# Altium schematic sheet LCDTFT_FPC40P_SPI.SchDoc
size A3; SheetNumber: 11; SheetTotal: 13
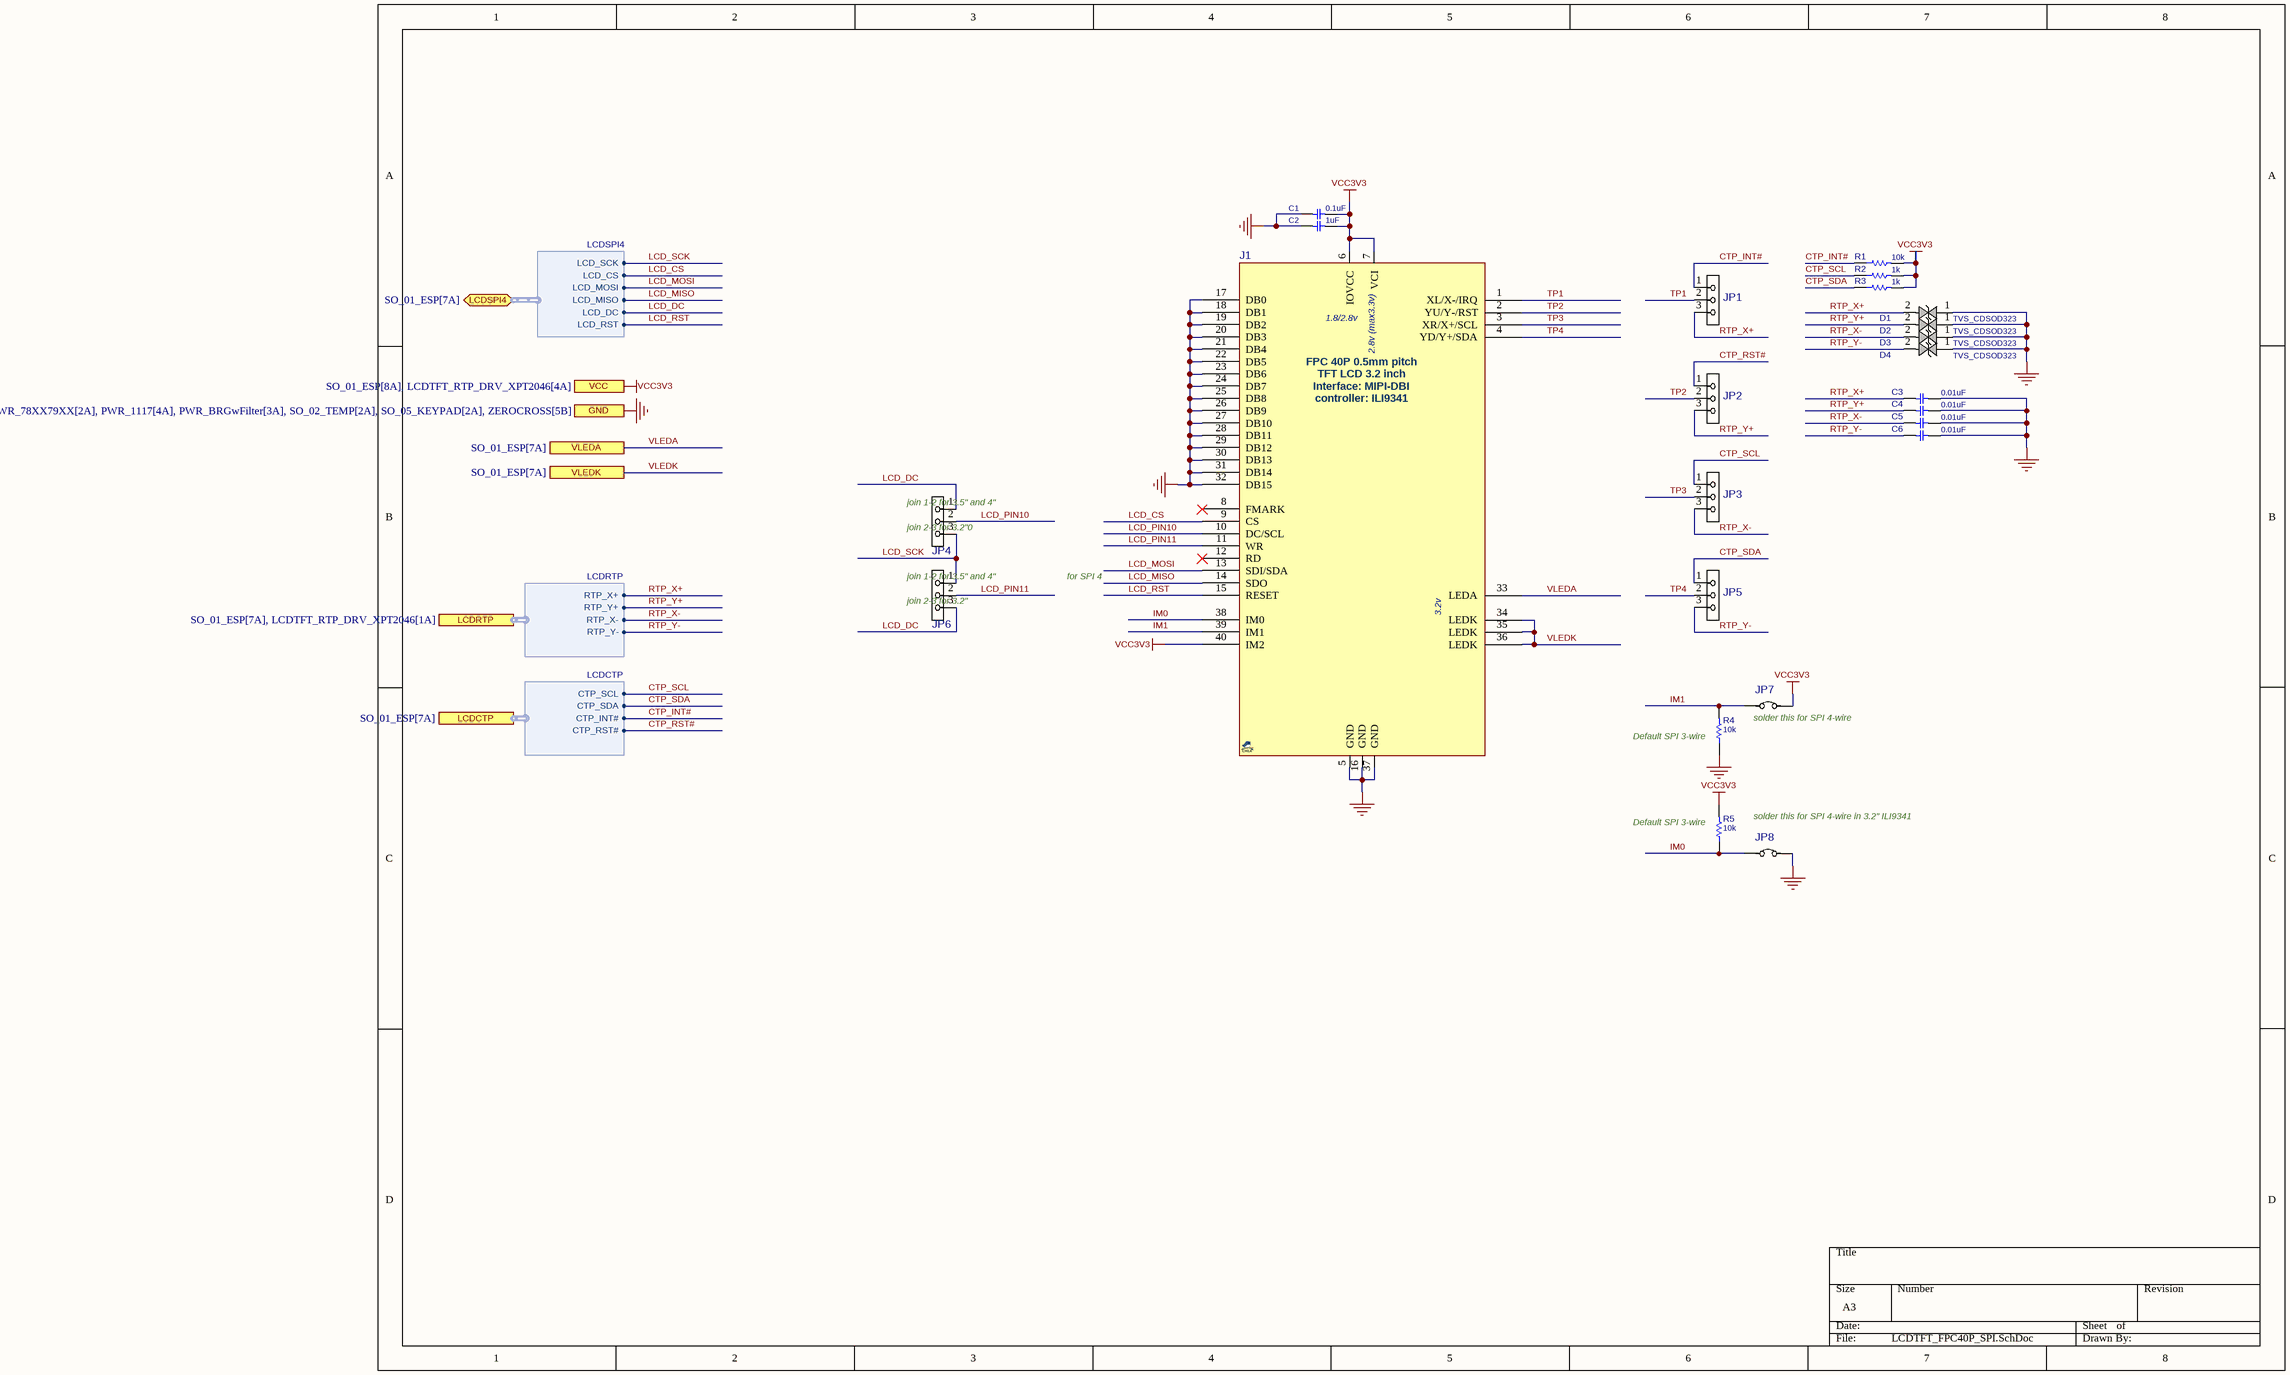
[diagram p0: LCDTFT_FPC40P_SPI.SchDoc]

## Parts
C1  0.1uF  [C0402]
C2  1uF  [C0402]
C3  0.01uF  [C0402]
C4  0.01uF  [C0402]
C5  0.01uF  [C0402]
C6  0.01uF  [C0402]
D1  TVS_CDSOD323  [D0805]
D2  TVS_CDSOD323  [D0805]
D3  TVS_CDSOD323  [D0805]
D4  TVS_CDSOD323  [D0805]
J1  FPC50_40  [FPC50_40T]  (value not drawn)
JP1  JMPHDR3PIN  [JP_3_60W]  (value not drawn)
JP2  JMPHDR3PIN  [JP_3_60W]  (value not drawn)
JP3  JMPHDR3PIN  [JP_3_60W]  (value not drawn)
JP4  JMPHDR3PIN  [JP_3_60W]  (value not drawn)
JP5  JMPHDR3PIN  [JP_3_60W]  (value not drawn)
JP6  JMPHDR3PIN  [JP_3_60W]  (value not drawn)
JP7  JMPSOLDER  [JP_60X100]  (value not drawn)
JP8  JMPSOLDER  [JP_60X100]  (value not drawn)
R1  10k  [R0402]
R2  1k  [R0402]
R3  1k  [R0402]
R4  10k  [R0402]
R5  10k  [R0402]

## Ports
GND (see SO_01_ESP[8A], ACCTRL_OPTOTRIAC[1A], DRV_BJT[1A], I2C_GPIOEXPANDER_PCF8574[1A], LCDTFT_RTP_DRV_XPT2046[4B], LEDBAKL_MP3202_AP3032[1B], PWR_78XX79XX[2A], PWR_1117[4A], PWR_BRGwFilter[3A], SO_02_TEMP[2A], SO_05_KEYPAD[2A], ZEROCROSS[5B]), LCDCTP (harness LCDCTP, see SO_01_ESP[7A]), LCDRTP (harness LCDRTP, see SO_01_ESP[7A], LCDTFT_RTP_DRV_XPT2046[1A]), LCDSPI4 (bidir, harness LCDSPI4, see SO_01_ESP[7A]), VCC (see SO_01_ESP[8A], LCDTFT_RTP_DRV_XPT2046[4A]), VLEDA (see SO_01_ESP[7A]), VLEDK (see SO_01_ESP[7A])

## Harnesses
LCDCTP: CTP_SCL, CTP_SDA, CTP_INT#, CTP_RST#
LCDSPI4: LCD_RST, LCD_MOSI, LCD_DC, LCD_SCK, LCD_CS, LCD_MISO
LCDRTP: RTP_X+, RTP_Y+, RTP_X-, RTP_Y-

## Nets
GND: C1.2 C2.2 C3.1 C4.1 C5.1 C6.1 D1.1 D2.1 D3.1 D4.1 J1.5(GND) J1.16(GND) J1.17(DB0) J1.18(DB1) J1.19(DB2) J1.20(DB3) J1.21(DB4) J1.22(DB5) J1.23(DB6) J1.24(DB7) J1.25(DB8) J1.26(DB9) J1.27(DB10) J1.28(DB11) J1.29(DB12) J1.30(DB13) J1.31(DB14) J1.32(DB15) J1.37(GND) JP8.2 R4.1 ; port GND
VCC3V3: C1.1 C2.1 J1.6(IOVCC) J1.7(VCI) J1.40(IM2) JP7.2 R1.2 R2.2 R3.2 R5.2 ; port VCC
CTP_INT#: JP1.1 R1.1 ; port LCDCTP.CTP_INT#
CTP_RST#: JP2.1 ; port LCDCTP.CTP_RST#
CTP_SCL: JP3.1 R2.1 ; port LCDCTP.CTP_SCL
CTP_SDA: JP5.1 R3.1 ; port LCDCTP.CTP_SDA
IM0: J1.38(IM0) JP8.1 R5.1
IM1: J1.39(IM1) JP7.1 R4.2
LCD_CS: J1.9(CS) ; port LCDSPI4.LCD_CS
LCD_DC: JP4.1 JP6.3 ; port LCDSPI4.LCD_DC
LCD_MISO: J1.14(SDO) ; port LCDSPI4.LCD_MISO
LCD_MOSI: J1.13(SDI/SDA) ; port LCDSPI4.LCD_MOSI
LCD_PIN10: J1.10(DC/SCL) JP4.2
LCD_PIN11: J1.11(WR) JP6.2
LCD_RST: J1.15(RESET) ; port LCDSPI4.LCD_RST
LCD_SCK: JP4.3 JP6.1 ; port LCDSPI4.LCD_SCK
RTP_X+: C3.2 D1.2 JP1.3 ; port LCDRTP.RTP_X+
RTP_X-: C5.2 D3.2 JP3.3 ; port LCDRTP.RTP_X-
RTP_Y+: C4.2 D2.2 JP2.3 ; port LCDRTP.RTP_Y+
RTP_Y-: C6.2 D4.2 JP5.3 ; port LCDRTP.RTP_Y-
TP1: J1.1(XL/X-/IRQ) JP1.2
TP2: J1.2(YU/Y-/RST) JP2.2
TP3: J1.3(XR/X+/SCL) JP3.2
TP4: J1.4(YD/Y+/SDA) JP5.2
VLEDA: J1.33(LEDA) ; port VLEDA
VLEDK: J1.34(LEDK) J1.35(LEDK) J1.36(LEDK) ; port VLEDK

Not connected (* = marked no-connect by the designer): J1 8(FMARK)* 12(RD)*

## Notes on the sheet
- (near JP4) join 1-2 for 3.5" and 4"
- (near JP4) join 2-3 for 3.2"0
- join 1-2 for 3.5" and 4"
- for SPI 4
- (near JP6) join 2-3 for 3.2"
- (near R4) Default SPI 3-wire
- (near JP7) solder this for SPI 4-wire
- (near R5) Default SPI 3-wire
- solder this for SPI 4-wire in 3.2" ILI9341
- (in symbol LCDTFT_DBI_FPC40P_3.2INCH) 1.8/2.8v; 2.8v (max3.3v); FPC 40P 0.5mm pitch; TFT LCD 3.2 inch; Interface: MIPI-DBI; controller: ILI9341; 3.2v

## Library data of the parts
C1 = CAP_SMD_MLCC: CAP, MLCC; PARAM: X7R, 10%, -55~125oC; MANF_P#: GRM155R71H104KE14D; MANF: Murata; PARAM2: 50v; PRICE: 100: 0.018$; ASSEMBLY: ASSEMBLY; VALUE: 0.1uF
C2 = CAP_SMD_MLCC: CAP, MLCC; PARAM: X5R, 10%; PRICE: 50,000:	$0.006; MANF_P#: -; MANF: -; PARAM2: -; ASSEMBLY: ASSEMBLY; VALUE: 1uF
C3-C6 = CAP_SMD_MLCC: CAP, MLCC; PARAM: X5R, 10%; PARAM2: 50v; PRICE: 50,000:	$0.006; MANF_P#: -; MANF: -; ASSEMBLY: ASSEMBLY; VALUE: 0.01uF
D1-D4 = TVS_CDSOD323: TVS, ESD PROTECT, Bidirectional; MANF_P#: CDSOD323-T12C; MANF: Bourns; PARAM2: 13.3VB, 12VR; PRICE: 0.7$; VALUE: TVS_CDSOD323
J1 = LCDTFT_DBI_FPC40P_3.2INCH: LCD TFT Color, FPC40P, 3.2" with touch; MANF: Hirose; MANF_P#: FH12A-40S-0.5SH; VALUE: FPC50_40
JP1-JP6 = JUMPER_SOLDER_3P: JUMPER, HEADER 3PIN; MANF: MANF; MANF_P#: MANF_P#; VALUE: JMPHDR3PIN
JP7 JP8 = JUMPER_SOLDER: JUMPER, HEADER 2PIN; MANF: MANF; MANF_P#: MANF_P#; VALUE: JMPSOLDER
R1-R5 = RES_SMD: RESISTOR, SMD; PARAM: 0.063W; DESC: DESCRIPTION; DIST#: MOUSER; PARAM2: 1%; MANF_P#: -; MANF: -; ASSEMBLY: ASSEMBLY; PRICE: 100= 0.3$
  R1 R4 R5: VALUE: 10k
  R2 R3: VALUE: 1k